# Altium schematic sheet USB.SchDoc: USB Input & Protection
size A3; SheetNumber: 5; SheetTotal: 5; ENG_APP_DATE: --/--/--; DSN_APP_DATE: --/--/--; CHK_APP_DATE: --/--/--
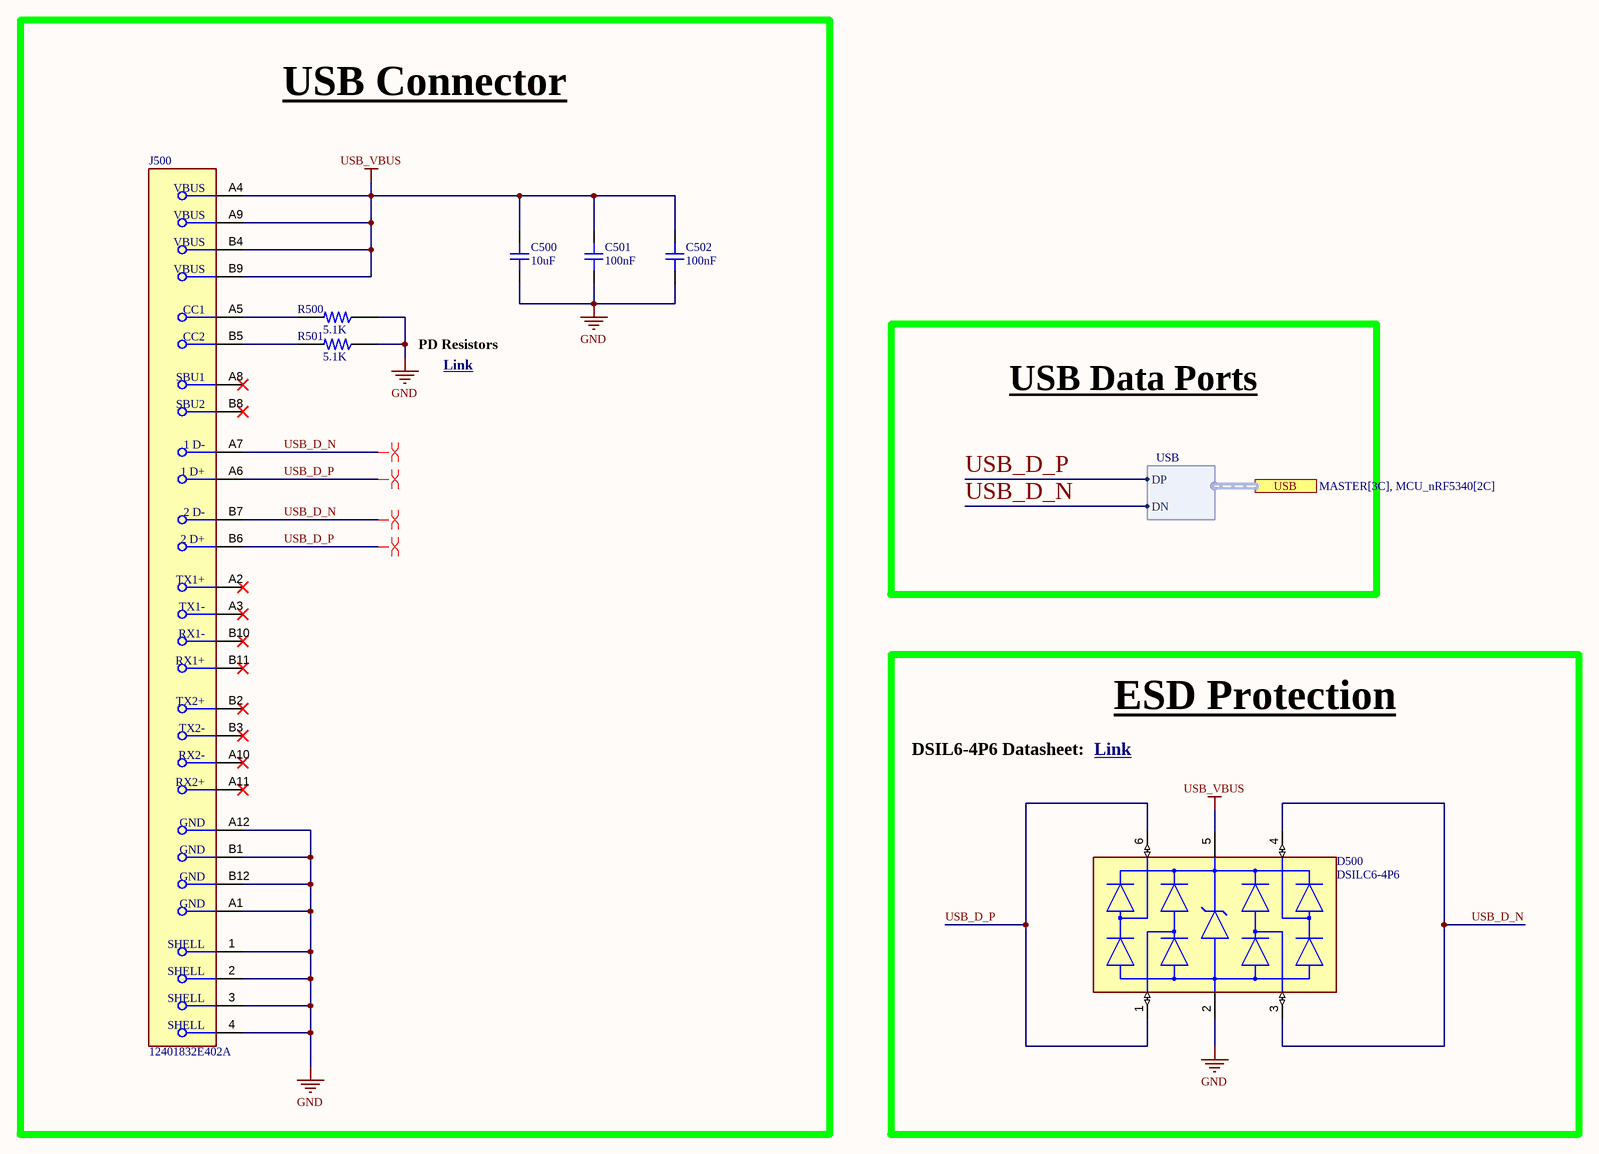
[diagram p0: USB.SchDoc]

## Parts
C500  10uF  [CAP_0603]
C501  100nF  [CAP_0603]
C502  100nF  [CAP_0603]
D500  DSILC6-4P6  [FP-SOT-666-MFG]
J500  12401832E402A  [FP-12401832E402A-MFG]
R500  5.1K  [RESC1607X60N]
R501  5.1K  [RESC1607X60N]

## Blocks framed on the sheet
USB Connector: C500-C502 J500 R500 R501
ESD Protection: D500

## Ports
USB (harness USB, see MASTER[3C], MCU_nRF5340[2C])

## Harnesses
USB: DN, DP

## Nets
GND: C500.1 C501.1 C502.1 D500.2(GND) J500.1(SHELL) J500.2(SHELL) J500.3(SHELL) J500.4(SHELL) J500.A1(GND) J500.A12(GND) J500.B1(GND) J500.B12(GND) R500.1 R501.1
USB_VBUS: C500.2 C501.2 C502.2 D500.5(VCC) J500.A4(VBUS) J500.A9(VBUS) J500.B4(VBUS) J500.B9(VBUS)
USB_D_N: D500.3(I/O2) D500.4(I/O3) J500.A7(1_D-) J500.B7(2_D-) ; port USB.DN
USB_D_P: D500.1(I/O1) D500.6(I/O4) J500.A6(1_D+) J500.B6(2_D+) ; port USB.DP
NetJ500_A5: J500.A5(CC1) R500.2
NetJ500_B5: J500.B5(CC2) R501.2

Not connected (* = marked no-connect by the designer): J500 A2(TX1+)* A3(TX1-)* A8(SBU1)* A10(RX2-)* A11(RX2+)* B2(TX2+)* B3(TX2-)* B8(SBU2)* B10(RX1-)* B11(RX1+)*

## Layout directives
differential pair: USB_D_N, USB_D_P

## Notes on the sheet
- PD Resistors
- Link <https://community.infineon.com/t5/Knowledge-Base-Articles/USB-Type-C-connector-Rp-Rd-and-Ra-termination-resistors/ta-p/253544>
- USB Data Ports
- DSIL6-4P6 Datasheet:
- Link <https://datasheet.ciiva.com/4511/cd00130230-99038-4511753.pdf?src-supplier=Mouser>
- DWG. NO.
- REV.
- SHT.
- THIS DOCUMENT AND THE DATA DISCLOSED HEREIN OR HEREWITH IS THE PROPERTY OF ALTIUM LIMITED AND MAY BE FREELY DISTRIBUTED IN WHOLE. NO RIGHTS ARE RESERVED OR EXPRESS OR IMPLIED WARANTEE GIVEN.
- REVISION
- DESCRIPTION
- DATE
- APPROVED
- ENG:
- APPROVALS
- PROJECT
- DSN:
- CHK:
- REFERENCE DOCUMENTS
- PROJECT REVISION:
- TITLE
- DOCUMENT REVISION:
- DESIGN ITEM:
- BOM:
- FAB DWG:
- PCB DWG:
- ASSY DWG:
- SCALE:
- SIZE
- B
- CAGE CODE
- FILE NAME
- DWG NO.
- SHEET
- OF
- REV

## Library data of the parts
C500-C502 = CAP_0603: Capacitor SMD 0603; Manufacturer: *; Manufacturer Part Number: *; Distributor Link: *; LCSC: *; Rating: *; Dielectric: *
D500 = CMP-12225-000033-1: TVS DIODE 5V SOT666; Manufacturer: STMicroelectronics; Number Of Channels: 4; Breakdown Voltage: 6V; Direction: Unidirectional; Peak Pulse Power: 90W; Capacitance: 1.5pF; Max Junction Temp: +125°C; Peak Pulse Current: 5A; Value: 1.5pF; Mouser Description: DSILC6 Series 4 Channel 6 V Uni-Directional Diode Array - SOT-666; Device Class L2: TVS Diodes; ComponentLink2URL: https://www.st.com/resource/en/datasheet/dsilc6-4xx.pdf; Category: Diode; Automotive: No; Lead Free: Yes; ComponentLink2Description: Datasheet; Octopart: https://octopart.com/dsilc6-4p6-stmicroelectronics-660265; Reverse Standoff Voltage: 5V; Height: 0.6mm; Package: SOT-666; Device Class L3: unset; Manufacturer Part Number: DSILC6-4P6; Temperature: to +125°C; Digikey Description: TVS DIODE 5V SOT666; Temperature Range High: +125°C; RoHS: TRUE; Device Class L1: Circuit Protection
J500 = CMP-02355-000004-1: CONN RCP USB3.1 TYPEC 24P SMD RA
R500 R501 = RC0603JR0710KL: 10 kOhms Â±5% 0.1W, 1/10W Chip Resistor 0603 (1608 Metric) Moisture Resistant Thick Film; MF: Yageo; SnapEDA_Link: https://www.snapeda.com/parts/RC0603JR0710KL/Yageo/view-part/?ref=snap; Package: 0603 Yageo; Value: *; MP: RC0603JR0710KL; Check_prices: https://www.snapeda.com/parts/RC0603JR0710KL/Yageo/view-part/?ref=eda